# EAGLE design CurrentAmp (EAGLE 6.5.0)
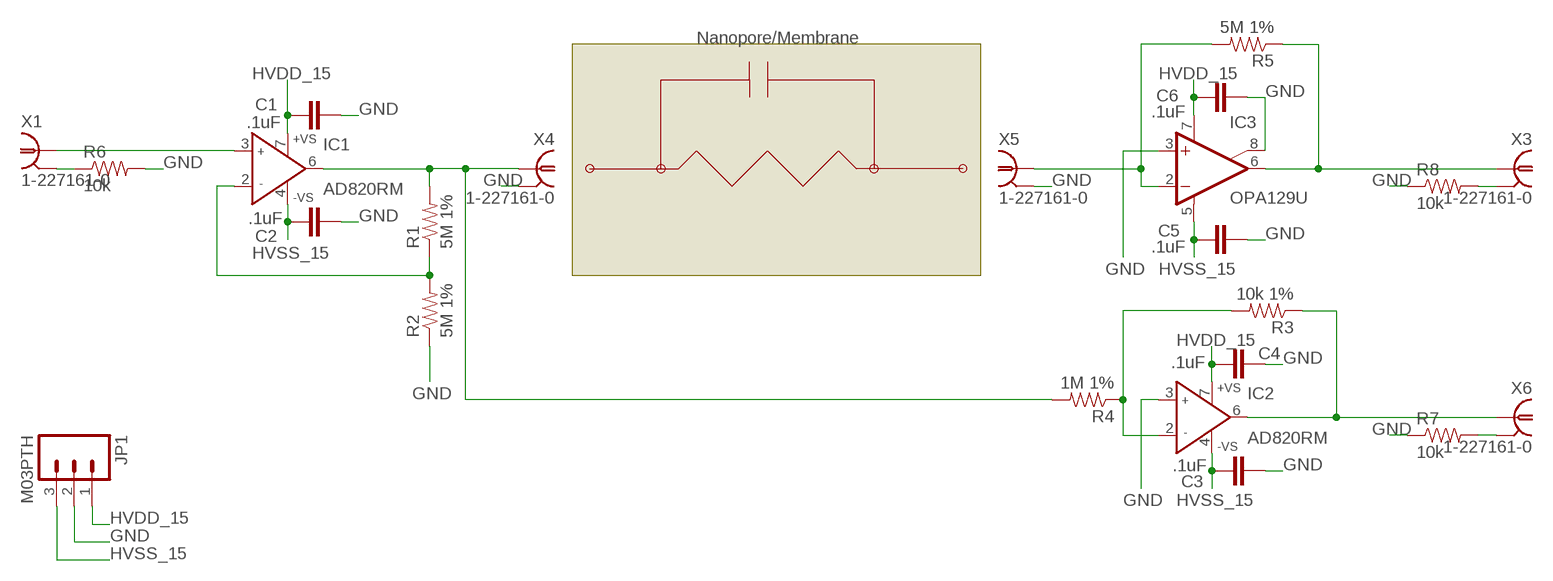
[diagram p0: schematic, sheet 1]

## Parts
C1  .1uF  CAP0805  [0805]
C2  .1uF  CAP0805  [0805]
C3  .1uF  CAP0805  [0805]
C4  .1uF  CAP0805  [0805]
C5  .1uF  CAP0805  [0805]
C6  .1uF  CAP0805  [0805]
IC1  AD820RM  [MSOP08]
IC2  AD820RM  [MSOP08]
IC3  OPA129U  [SO08]
JP1  M03PTH  [1X03]
R1  5M 1%  RESISTOR0805-RES  [0805]
R2  5M 1%  RESISTOR0805-RES  [0805]
R3  10k 1%  RESISTOR0805-RES  [0805]
R4  1M 1%  RESISTOR0805-RES  [0805]
R5  5M 1%  RESISTOR0805-RES  [0805]
R6  10k  RESISTOR0805-RES  [0805]
R7  10k  RESISTOR0805-RES  [0805]
R8  10k  RESISTOR0805-RES  [0805]
X1  1-227161-0  [AMP_227161]
X3  1-227161-0  [AMP_227161]
X4  1-227161-0  [AMP_227161]
X5  1-227161-0  [AMP_227161]
X6  1-227161-0  [AMP_227161]

## Nets
GND: C1.2 C2.2 C3.2 C4.2 C5.2 C6.2 IC2.3(IN+) IC3.3(+IN) IC3.8(SUBS) JP1.2 R2.1 R6.2 R7.1 R8.1 X4.2 X5.2
HVDD_15: C1.1 C4.1 C6.1 IC1.7(+VS) IC2.7(+VS) IC3.7(V+) JP1.1
HVSS_15: C2.1 C3.1 C5.1 IC1.4(-VS) IC2.4(-VS) IC3.5(V-) JP1.3
N$1: IC1.2(IN-) R1.1 R2.2
N$3: IC1.3(IN+) X1.1
N$4: IC2.2(IN-) R3.2 R4.1
N$5: IC2.6(OUT) R3.1 X6.1
N$6: IC1.6(OUT) R1.2 R4.2 X4.1
N$7: IC3.6(OUT) R5.1 X3.1
N$8: IC3.2(-IN) R5.2 X5.1
N$9: R6.1 X1.2
N$11: R8.2 X3.2
N$14: R7.2 X6.2

## Notes on the sheet
- Nanopore/Membrane

## Library data of the parts
C1-C6 = ASL:CAP: Capacitor Standard 0603 ceramic capacitor, and 0.1" leaded capacitor.
IC1 IC2 = analog-devices:AD820: Single-Supply, Rail-to-Rail, Low Power, FET Input Op Amp Source: http://www.analog.com/static/imported-files/data_sheets/AD820.pdf; MF: ALTERA CORPORATION; MPN: AD820ARZ; OC_FARNELL: 9426469; OC_NEWARK: 88H0196
IC3 = burr-brown:OPA129: Difet Operational Amplifier Ultra-Low Bias Current; MF: TEXAS INSTRUMENTS; MPN: OPA129U; OC_FARNELL: 1206925; OC_NEWARK: 80K6004
JP1 = ASL:M03: Header 3 Standard 3-pin 0.1" header. Use with straight break away headers (SKU : PRT-00116), right angle break away headers (PRT-00553), swiss pins (PRT-00743), machine pins (PRT-00117), and female headers (PRT-00115). Molex polarized connector foot print use with SKU : PRT-08232 with associated crimp pins and housings.
R1-R8 = ASL:RESISTOR: Resistor Basic schematic elements and footprints for 0603, 1206, and PTH resistors.
X1 X3-X6 = con-coax:?227161*: JACK, RIGHT ANGLE, 50 OHM, PCB, BNC Source: amp_227161.pdf; MF: TYCO ELECTRONICS; MPN: 1-227161; OC_FARNELL: unknown; OC_NEWARK: 33B3200

## Board
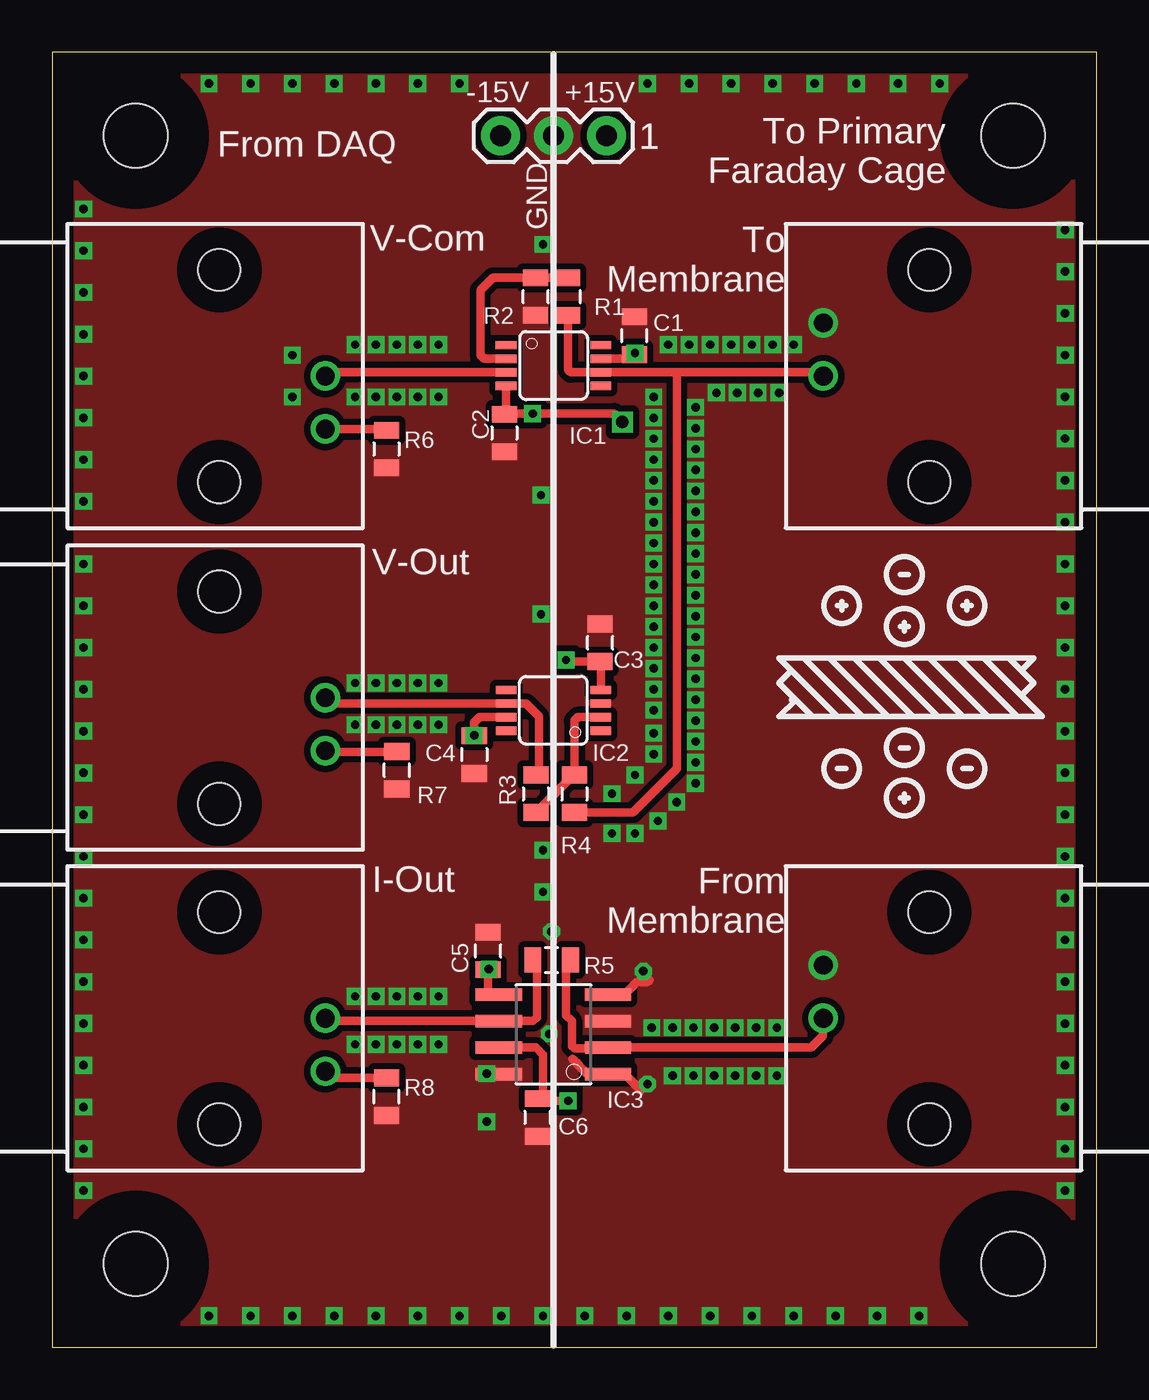
[diagram p1: board, top side]
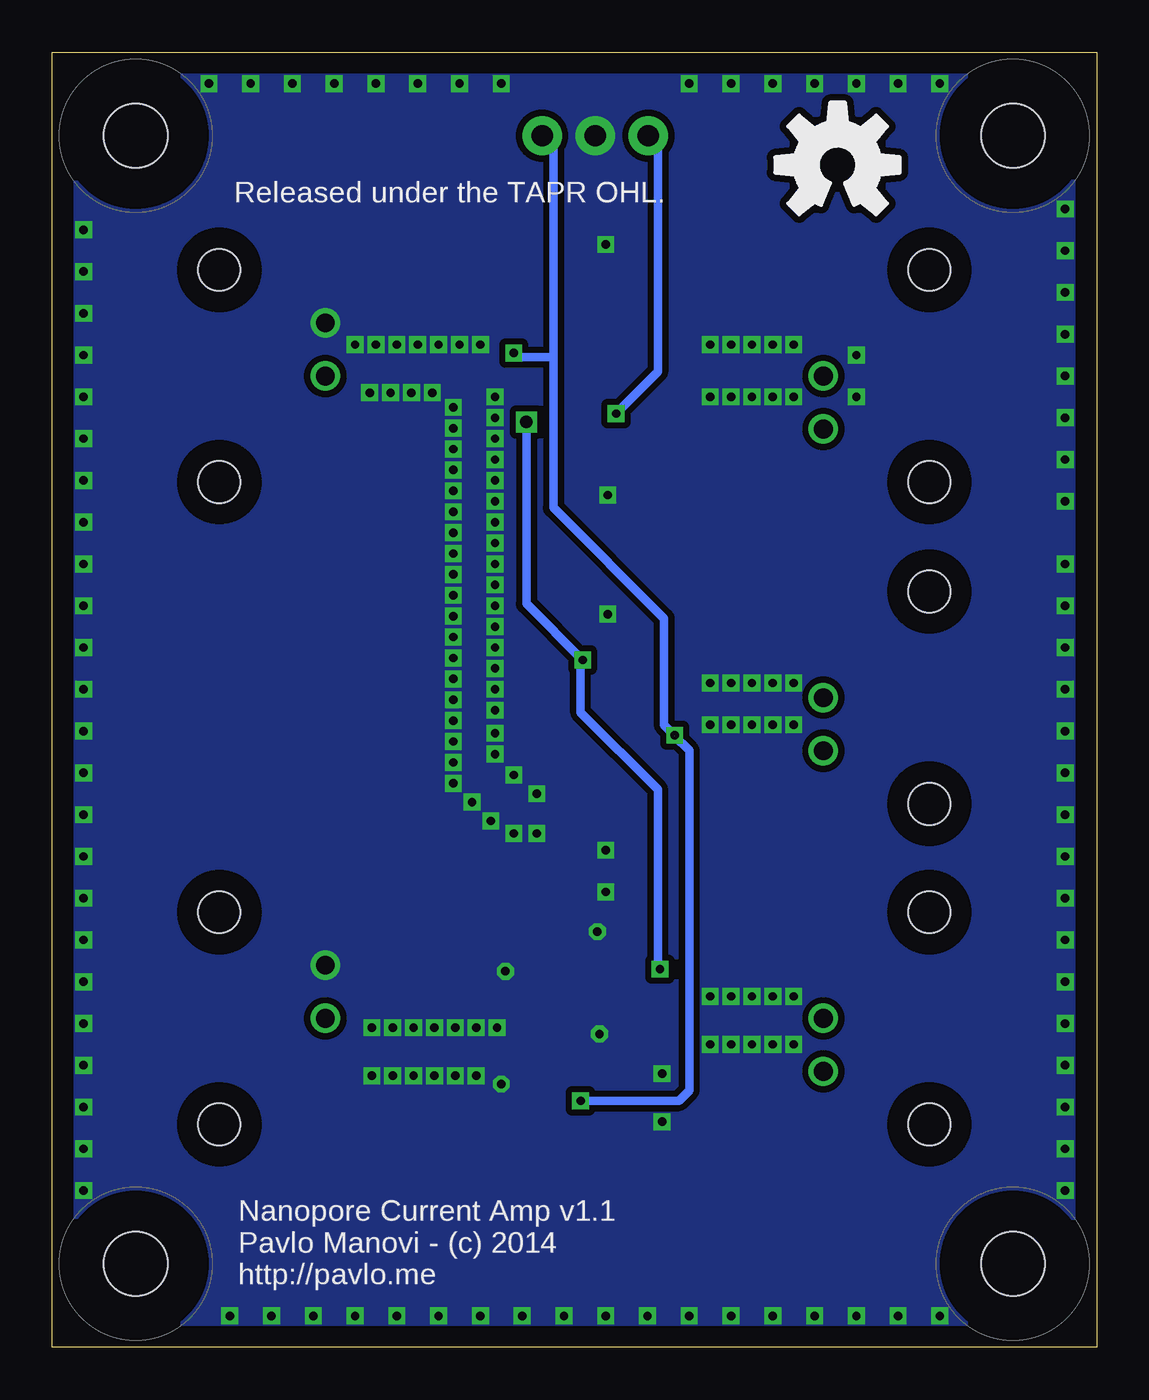
[diagram p2: board, bottom side, seen from below]

Size 50 x 62 mm. Coordinates in mm from the lower left corner, seen from the top.
Outline: 0,62 0,0 50,0 50,62 0,62
Copper layers (1*16): Top 0.035mm / dielectric 1.5mm / Bottom 0.035mm
Design rules "default": minimum track width 10mil, minimum drill 24mil, track to track 8mil, track to pad 8mil, pad to pad 8mil, via to via 8mil, smd to smd 8mil, copper to edge 40mil, drill to drill 8mil, minimum pad ring 10mil, minimum via ring 8mil, stop-mask expansion 4mil, vias tented up to drill 0mil, thermal gap 10mil

### Footprints (pad centres in the part's own frame; a part is rotated, then mirrored left to right if it is on the bottom)
0805 = smd 0.8 x 1.2: 1 -0.9,0; 2 0.9,0
STAND-OFF-TIGHT = hole 3.048: 0,0
MSOP08 = smd 0.4 x 1: 1 -0.976,-2.263; 2 -0.326,-2.263; 3 0.324,-2.263; 4 0.974,-2.263; 5 0.974,2.262; 6 0.324,2.262; 7 -0.326,2.262; 8 -0.976,2.262
SO08 = smd 0.61 x 2.21: 1 -1.905,-2.616; 2 -0.635,-2.616; 3 0.635,-2.616; 4 1.905,-2.616; 5 1.905,2.616; 6 0.635,2.616; 7 -0.635,2.616; 8 -1.905,2.616
1X03 = drill 1.016 pad 1.88: 1 -2.54,0; 2 0,0; 3 2.54,0
AMP_227161 = drill 0.9 pad 1.27: 1 0,-5.08; 2 -2.54,-5.08 | hole 2: -5.08,0; 5.08,0

### Placement (x,y rotation side)
C1  27.87,48.42 90 top
C2  21.65,43.77 270 top
C3  26.24,33.73 90 top
C4  20.21,28.37 270 top
C5  20.87,18.98 90 top
C6  23.23,11 270 top
E$1  [STAND-OFF-TIGHT]  4,4 0 top
E$2  [STAND-OFF-TIGHT]  46,4 0 top
E$3  [STAND-OFF-TIGHT]  46,58 0 top
E$4  [STAND-OFF-TIGHT]  4,58 0 top
IC1  24,47 270 top
IC2  24,30.5 90 top
IC3  24,14.98 90 top
JP1  24,58 180 top
R1  24.67,50.3 270 top
R2  23.15,50.3 90 top
R3  23.16,26.5 270 top
R4  25,26.5 270 top
R5  23.91,18.54 0 top
R6  16,43 270 top
R7  16.5,27.63 90 top
R8  16,12 90 top
X1  8,46.5 90 top
X3  8,15.75 90 top
X4  42,46.5 270 top
X5  42,15.75 270 top
X6  8,31.1 90 top

### Tracks (layer width: path | path; a pad name or v marks a point on that pad's centre or on a via)
GND  (via drill 0.4)
  Top 0.406: 25.7,17 27.5,17 28,17.5 28.5,17.5 28.6,17.6 | 28.2,12.3 27.4,13.1 25.6,13.1 24.9,13.8
  other vias: 14.5,48 15.5,48 16.5,48 17.5,48 18.5,48 18.5,45.5 17.5,45.5 16.5,45.5 15.5,45.5 14.5,45.5 11.5,47.5 11.5,45.5 29.5,48 30.5,48 31.5,48 32.5,48 33.5,48 34.5,48 28.8,45.5 35.5,48 17.5,16.8 18.5,16.8 16.5,16.8 15.5,16.8 14.5,16.8 14.5,14.5 15.5,14.5 16.5,14.5 17.5,14.5 18.5,14.5 28.7,15.3 29.7,15.3 30.7,15.3 31.7,15.3 32.7,15.3 33.7,15.3 34.7,15.3 29.7,13 30.7,13 31.7,13 32.7,13 33.7,13 34.7,13 1.5,54.5 1.5,52.5 1.5,50.5 1.5,48.5 1.5,46.5 1.5,44.5 1.5,42.5 1.5,40.5 1.5,21.5 1.5,19.5 1.5,17.5 1.5,15.5 1.5,13.5 1.5,11.5 1.5,9.5 1.5,37.5 1.5,35.5 1.5,33.5 1.5,31.5 1.5,29.5 1.5,27.5 1.5,25.5 1.5,23.5 7.5,1.5 9.5,1.5 11.5,1.5 13.5,1.5 15.5,1.5 17.5,1.5 19.5,1.5 19.5,1.5 21.5,1.5 23.5,1.5 25.5,1.5 27.5,1.5 48.5,41.5 48.5,43.5 48.5,45.5 48.5,47.5 48.5,49.5 48.5,51.5 48.5,53.5 42.5,60.5 40.5,60.5 38.5,60.5 36.5,60.5 34.5,60.5 32.5,60.5 30.5,60.5 28.5,60.5 19.5,60.5 17.5,60.5 15.5,60.5 13.5,60.5 11.5,60.5 9.5,60.5 7.5,60.5 14.5,31.8 15.5,31.8 16.5,31.8 17.5,31.8 18.5,31.8 14.5,29.8 15.5,29.8 16.5,29.8 17.5,29.8 18.5,29.8 23.5,21.8 23.5,23.8 23.4,40.8 23.5,52.8 23.4,35.1 28.8,44.5 28.8,43.5 28.8,42.5 28.8,41.5 28.8,40.5 28.8,39.5 28.8,38.5 28.8,37.5 28.8,36.5 28.8,35.5 28.8,34.5 28.8,33.5 28.8,32.5 28.8,31.5 28.8,30.5 28.8,29.4 28.8,28.4 27.9,27.4 26.8,26.5 26.8,24.6 27.9,24.6 29,25.2 29.9,26.1 30.8,27 30.8,28 30.8,29 30.8,30 30.8,31 30.8,32 30.8,33 30.8,34 30.8,35 30.8,36 30.8,37 30.8,38 30.8,39 30.8,40 30.8,41 30.8,42 30.8,43 30.8,44 30.8,45 31.8,45.7 32.8,45.7 33.8,45.7 34.8,45.7 20.8,13.1 23.8,15 23.9,19.9 28.3,18 28.5,12.6 20.8,10.8 48.5,39.5 48.5,37.5 48.5,35.5 48.5,33.5 48.5,31.5 48.5,29.5 48.5,27.5 48.5,25.5 48.5,23.5 48.5,21.5 48.5,19.5 48.5,17.5 48.5,15.5 48.5,13.5 48.5,11.5 48.5,9.5 48.5,7.5 29.5,1.5 31.5,1.5 33.5,1.5 35.5,1.5 37.5,1.5 39.5,1.5 41.5,1.5 1.5,7.5
  pour Top (isolate 0.305, rank 3, no thermals): 0,62 50,62 50,0 0,0
  pour Bottom (isolate 0.305, rank 3, no thermals): 0,62 50,62 50,0 0,0
HVDD_15  (via drill 0.4)  (1 unrouted)
  Top 0.406: IC1.7 27.68,47.33 C1.1 27.87,47.57 v27.9,47.6 | IC2.7 20.47,30.17 20.2,29.9 v20.2,29.3 C4.1 | IC3.7 23.15,14.35 23.5,14 23.5,12.17 C6.1 23.33,11.8 v24.7,11.8
  Bottom 0.406: 26,47.4 26,57.46 JP1.1 | v27.9,47.6 27.9,47.5 27.8,47.4 26,47.4 | v24.7,11.8 20,11.8 19.5,12.3 19.5,28.56 C4.1 | 26,47.4 26,40.2 20.7,34.9 20.7,29.8 v20.2,29.3
HVSS_15  (via drill 0.4, 0.6)
  Top 0.406: IC1.4 21.74,44.96 C2.1 | 20.87,16.97 C5.1 v20.9,18.1 | 20.87,16.97 20.8,16.9 | 20.87,16.97 21.3,16.97 IC3.5 | IC2.4 26.26,32.8 C3.1 24.67,32.83 v24.6,32.9 | C2.1 21.67,44.67 21.7,44.7 | C2.1 21.68,44.7 v23,44.7 26.9,44.7 v27.3,44.3
  Bottom 0.406: v20.9,18.1 21,18.1 21,26.7 24.7,30.4 24.7,32.8 v24.6,32.9 27.3,35.6 v27.3,44.3 | JP1.3 21,57.54 21,46.7 v23,44.7
N$1
  Top 0.406: R1.1 R2.2 21.1,51.2 20.5,50.6 20.5,47.5 20.67,47.33 IC1.2
N$3
  Top 0.406: IC1.3 13.39,46.68 X1.1
N$4
  Top 0.406: R4.1 24.96,27.4 | 24.96,27.4 24.63,27.07 R3.2 | IC2.2 25.17,30.17 25,30 25,27.44 24.96,27.4
N$5
  Top 0.406: X6.1 13.42,30.82 IC2.6 22.68,30.82 23.3,30.2 23.3,27.54 R3.1
N$6
  Top 0.406: 29.9,46.68 IC1.6 24.82,46.68 24.7,46.8 24.7,49.37 R1.2 | 29.9,46.68 36.7,46.68 X4.1 | R4.2 27.8,25.6 29.9,27.7 29.9,46.68
N$7
  Top 0.406: X3.1 13.35,15.62 IC3.6 23.02,15.62 23.2,15.8 23.2,18.25 R5.1
N$8
  Top 0.406: R5.2 24.6,18.53 24.6,15.9 24.88,15.62 24.88,14.42 25,14.3 26.57,14.3 IC3.2 36.35,14.35 36.9,14.9 36.9,15.73 X5.1
N$9
  Top 0.406: X1.2 15.95,43.95 R6.1
N$10
  Bottom 0.2: 11.61,54.69 arc-9 11.31,54.85 10.55,54.24 10.04,54.75 10.65,55.51 arc-19 10.39,56.14 9.42,56.23 9.42,56.97 10.39,57.06 arc-19 10.65,57.69 10.04,58.45 10.55,58.96 11.31,58.35 arc-19 11.94,58.61 12.03,59.58 12.77,59.58 12.86,58.61 arc-19 13.49,58.35 14.25,58.96 14.76,58.45 14.15,57.69 arc-19 14.41,57.06 15.38,56.97 15.38,56.23 14.41,56.14 arc-19 14.15,55.51 14.76,54.75 14.25,54.24 13.49,54.85 arc-9 13.19,54.69 12.76,55.73 arc68 13.34,56.6 arc248 12.04,55.73 11.61,54.69
N$11
  Top 0.406: R8.2 13.39,12.9 X3.2
N$14
  Top 0.406: R7.2 16.46,28.49 13.15,28.49 X6.2

### Text on the board
tNames: +15V | -15V | To Primary / Faraday Cage | From DAQ | GND | To / Membrane | V-Com | V-Out | From / Membrane | I-Out
bNames: Released under the TAPR OHL. | Nanopore Current Amp v1.1 / Pavlo Manovi - (c) 2014 / http://pavlo.me